# Altium schematic sheet DC_Power.SchDoc
size A; SheetNumber: 1; SheetTotal: 2
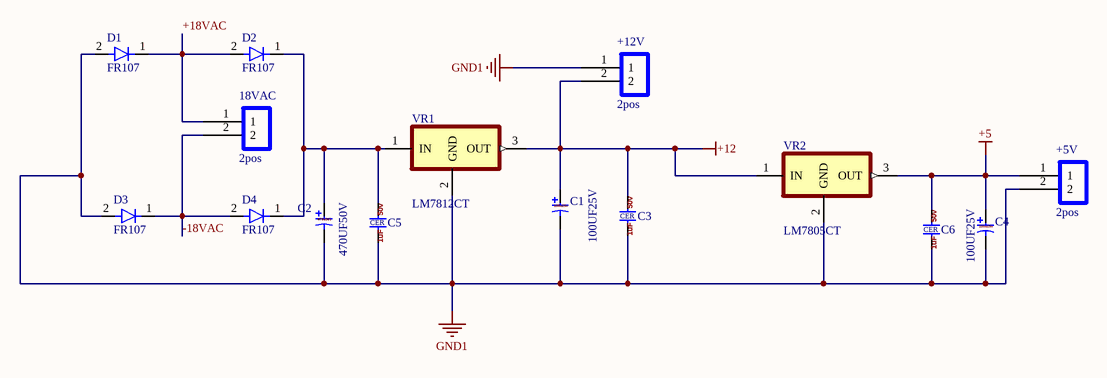
[diagram p0: DC_Power.SchDoc]

## Parts
18VAC  2pos  [2POS]
+5V  2pos  [2POS]
+12V  2pos  [2POS]
C1  100UF25V  [CAP LS-2.5mm D6.3 H7 - duplicate]
C2  470UF50V  [CAP_RADIAL_D13.0_P5.0_H20.0]
C3  1UFCER  [CAP-CER-2.54]  (value not drawn)
C4  100UF25V  [CAP LS-2.5mm D6.3 H7 - duplicate]
C5  1UFCER  [CAP-CER-2.54]  (value not drawn)
C6  1UFCER  [CAP-CER-2.54]  (value not drawn)
D1  FR107  [DIOAD1036W78L470D235]
D2  FR107  [DIOAD1036W78L470D235]
D3  FR107  [DIOAD1036W78L470D235]
D4  FR107  [DIOAD1036W78L470D235]
VR1  LM7812CT  [TO254P1054X470X1955-3]
VR2  LM7805CT  [TO254P1054X470X1955-3]

## Nets
+5: +5V.1 C4.1 C6.2 VR2.3(OUT)
+12: +12V.2 C1.1 C3.2 VR1.3(OUT) VR2.1(IN)
GND1: +5V.2 +12V.1 C1.2 C2.2 C3.1 C4.2 C5.1 C6.1 D1.2 D3.2 VR1.2(GND) VR2.2(GND)
+18VAC: 18VAC.1 D1.1 D2.2
-18VAC: 18VAC.2 D3.1 D4.2
NetC2_1: C2.1 C5.2 D2.1 D4.1 VR1.1(IN)

## Notes on the sheet
- (in symbol 1UFCER) 50v; CER; 1uF
- (in symbol 100UF25V) 100u25v
- (in symbol 470UF50V) 470u50v

## Library data of the parts
18VAC +5V +12V = 2pos: P2.54mm
C1 C4 = 100UF25V: CAP TH AL: 100U 25V; LCSC Part #: C43351; Unit Price: 0.0057
C2 = 470UF50V: CAP TH AL: 470U 50V; LCSC Part #: C43351; Unit Price: 0.0057
C3 C5 C6 = 1UFCER: CAP: CER 1UF 50V; LCSC Part #: C1848; Unit Price: 0.0104
D1-D4 = FR107: DIODE: GEN 1A 1.0V@1A 1kV DO-41 TH; LCSC Part #: C36138; Unit Price: 0.0313
VR1 = LM7812CT: 1.5-A, 12-V, linear voltage regulator; MF: Texas Instruments; MP: LM7812CT/NOPB; SnapEDA_Link: https://www.snapeda.com/parts/LM7812CT/NOPB/Texas+Instruments/view-part/?ref=snap; Package: TO-220-3 Texas Instruments; Value: *; Check_prices: https://www.snapeda.com/parts/LM7812CT/NOPB/Texas+Instruments/view-part/?ref=eda
VR2 = LM7805CT: 1.5-A,  5-V, linear voltage regulator; MF: Texas Instruments; MP: LM7812CT/NOPB; SnapEDA_Link: https://www.snapeda.com/parts/LM7812CT/NOPB/Texas+Instruments/view-part/?ref=snap; Package: TO-220-3 Texas Instruments; Value: *; Check_prices: https://www.snapeda.com/parts/LM7812CT/NOPB/Texas+Instruments/view-part/?ref=eda